# EAGLE design smd_basic_dual_powerb.test1 (EAGLE 5.06)
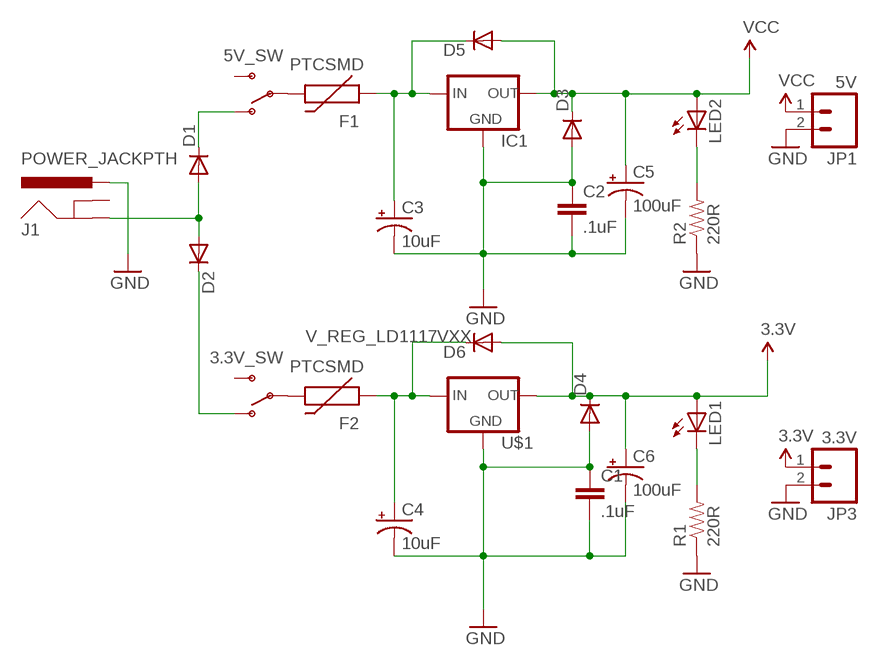
[diagram p0: schematic, sheet 1]

## Parts
3.3V_SW  SWITCH-SPSTSMD2  [SWITCH-SPDT-SMD]
5V_SW  SWITCH-SPSTSMD2  [SWITCH-SPDT-SMD]
C1  .1uF  CAP0603-CAP  [0603-CAP]
C2  .1uF  CAP0603-CAP  [0603-CAP]
C3  10uF  CAP_POL1206  [EIA3216]
C4  10uF  CAP_POL1206  [EIA3216]
C5  100uF  CAP_POL7343  [EIA7343]
C6  100uF  CAP_POL7343  [EIA7343]
D1  DIODESOD  [SOD-323]
D2  DIODESOD  [SOD-323]
D3  DIODESOD  [SOD-323]
D4  DIODESOD  [SOD-323]
D5  DIODESOD  [SOD-323]
D6  DIODESOD  [SOD-323]
F1  PTCSMD  [PTC-1206]
F2  PTCSMD  [PTC-1206]
IC1  V_REG_78XXSIDE  [78XXL]
J1  POWER_JACKPTH  [POWER_JACK_PTH]
JP1  5V  M02LOCK  [1X02_LOCK]
JP3  3.3V  M02LOCK  [1X02_LOCK]
LED1  LEDCHIP-LED0603  [CHIP-LED0603]
LED2  LEDCHIP-LED0603  [CHIP-LED0603]
R1  220R  RESISTOR0603-RES  [0603-RES]
R2  220R  RESISTOR0603-RES  [0603-RES]
U$1  V_REG_LD1117VXX  [78XXL]

## Nets
3.3V: C6.A(+) D4.1(C) D6.2(A) JP3.1 LED1.A U$1.GND(OUT)
GND: C1.1 C1.2 C2.1 C2.2 C3.C(-) C4.C(-) C5.C(-) C6.C(-) D3.2(A) D4.2(A) IC1.GND J1.PWR JP1.2 JP3.2 R1.1 R2.1 U$1.IN(GND)
N$1: D1.2(A) D2.2(A) J1.GND
N$2: 5V_SW.2(P) F1.2
N$3: 3.3V_SW.2(P) F2.2
N$4: 5V_SW.1(O) D1.1(C)
N$5: 3.3V_SW.1(O) D2.1(C)
N$6: C3.A(+) D5.1(C) F1.1 IC1.IN
N$7: C4.A(+) D6.1(C) F2.1 U$1.OUT(IN)
N$12: LED2.C R2.2
N$14: LED1.C R1.2
VCC: C5.A(+) D3.1(C) D5.2(A) IC1.OUT JP1.1 LED2.A
Unconnected: 3.3V_SW.3(S) 5V_SW.3(S) J1.GNDBREAK

## Library data of the parts
3.3V_SW 5V_SW = SparkFun:SWITCH-SPST: SPST Switch Simple slide switch. Spark Fun Electronics SKU : COM-00102
C1 C2 = SparkFun:CAP: Capacitor Standard 0603 ceramic capacitor, and 0.1" leaded capacitor.
C3-C6 = SparkFun:CAP_POL: Capacitor Polarized These are standard SMD and PTH capacitors. Normally 10uF, 47uF, and 100uF in electrolytic and tantalum varieties. Always verify the external diameter of the through hole cap, it varies with capacity, voltage, and manufacturer. The EIA devices should be standard.
D1-D6 = SparkFun:DIODE: Diode These are standard reverse protection diodes and small signal diodes. SMA package can handle up to about 1A. SOD-323 can handle about 200mA. What the SOD-323 package when ordering, there are some mfgs out there that are 5-pin packages.
F1 F2 = SparkFun:PTC: Resettable Fuse PTC Resettable Fuse. Spark Fun Electronics SKU : COM-08357
IC1 = SparkFun:V_REG_78XX: Voltage Regulator Standard 7805 5V regulator. IGO (Input Ground Output). Spark Fun Electronics SKU : COM-00107
J1 = SparkFun:POWER_JACK: Power Jack This is the standard 5.5mm barrel jack for power. The PTH is the most common, proven, reliable, footprint. All others are experimental. The Slot footprint only works if the mill layer is transmitted to the PCB fab house so be warned. Spark Fun Electronics SKU : PRT-00119. Mating wall wart : TOL-00298 (and others)
JP1 JP3 = SparkFun:M02: Header 2 Standard 2-pin 0.1" header. Use with straight break away headers (SKU : PRT-00116), right angle break away headers (PRT-00553), swiss pins (PRT-00743), machine pins (PRT-00117), and female headers (PRT-00115). Molex polarized connector foot print use with SKU : PRT-08233 with associated crimp pins and housings.
LED1 LED2 = led:LED: LED OSRAM: - CHIPLED LG R971, LG N971, LY N971, LG Q971, LY Q971, LO R971, LY R971 LH N974, LH R974 LS Q976, LO Q976, LY Q976 LO Q996 - Hyper CHIPLED LW Q18S LB Q993, LB Q99A, LB R99A - SideLED LS A670, LO A670, LY A670, LG A670, LP A670 LB A673, LV A673, LT A673, LW A673 LH A674 LY A675 LS A676, LA A676, LO A676, LY A676, LW A676 LS A679, LY A679, LG A679 - Hyper Micro SIDELED® LS Y876, LA Y876, LO Y876, LY Y876 LT Y87S - SmartLED LW L88C, LW L88S LB L89C, LB L89S, LG L890 LS L89K, LO L89K, LY L89K LS L896, LA L896, LO L896, LY L896 - TOPLED LS T670, LO T670, LY T670, LG T670, LP T670 LSG T670, LSP T670, LSY T670, LOP T670, LYG T670 LG T671, LOG T671, LSG T671 LB T673, LV T673, LT T673, LW T673 LH T674 LS T676, LA T676, LO T676, LY T676, LB T676, LH T676, LSB T676, LW T676 LB T67C, LV T67C, LT T67C, LS T67K, LO T67K, LY T67K, LW E67C LS E67B, LA E67B, LO E67B, LY E67B, LB E67C, LV E67C, LT E67C LW T67C LS T679, LY T679, LG T679 LS T770, LO T770, LY T770, LG T770, LP T770 LB T773, LV T773, LT T773, LW T773 LH T774 LS E675, LA E675, LY E675, LS T675 LS T776, LA T776, LO T776, LY T776, LB T776 LHGB T686 LT T68C, LB T68C - Hyper Mini TOPLED® LB M676 - Mini TOPLED Santana® LG M470 LS M47K, LO M47K, LY M47K Source: http://www.osram.convergy.de LUXEON: - LUMILED® LXK2-PW12-R00, LXK2-PW12-S00, LXK2-PW14-U00, LXK2-PW14-V00 LXK2-PM12-R00, LXK2-PM12-S00, LXK2-PM14-U00 LXK2-PE12-Q00, LXK2-PE12-R00, LXK2-PE12-S00, LXK2-PE14-T00, LXK2-PE14-U00 LXK2-PB12-K00, LXK2-PB12-L00, LXK2-PB12-M00, LXK2-PB14-N00, LXK2-PB14-P00, LXK2-PB14-Q00 LXK2-PR12-L00, LXK2-PR12-M00, LXK2-PR14-Q00, LXK2-PR14-R00 LXK2-PD12-Q00, LXK2-PD12-R00, LXK2-PD12-S00 LXK2-PH12-R00, LXK2-PH12-S00 LXK2-PL12-P00, LXK2-PL12-Q00, LXK2-PL12-R00 Source: www.luxeon.com KINGBRIGHT: KA-3528ASYC Source: www.kingbright.com
R1 R2 = SparkFun:RESISTOR: Resistor Basic schematic elements and footprints for 0603, 1206, and PTH 1/10th watt (small) resistors.
U$1 = SparkFun:V_REG_LD1117VXX: LD1117VXX voltage regulator. We carry the 3.3V version (COM-00526) in TO-220 package.

## Board
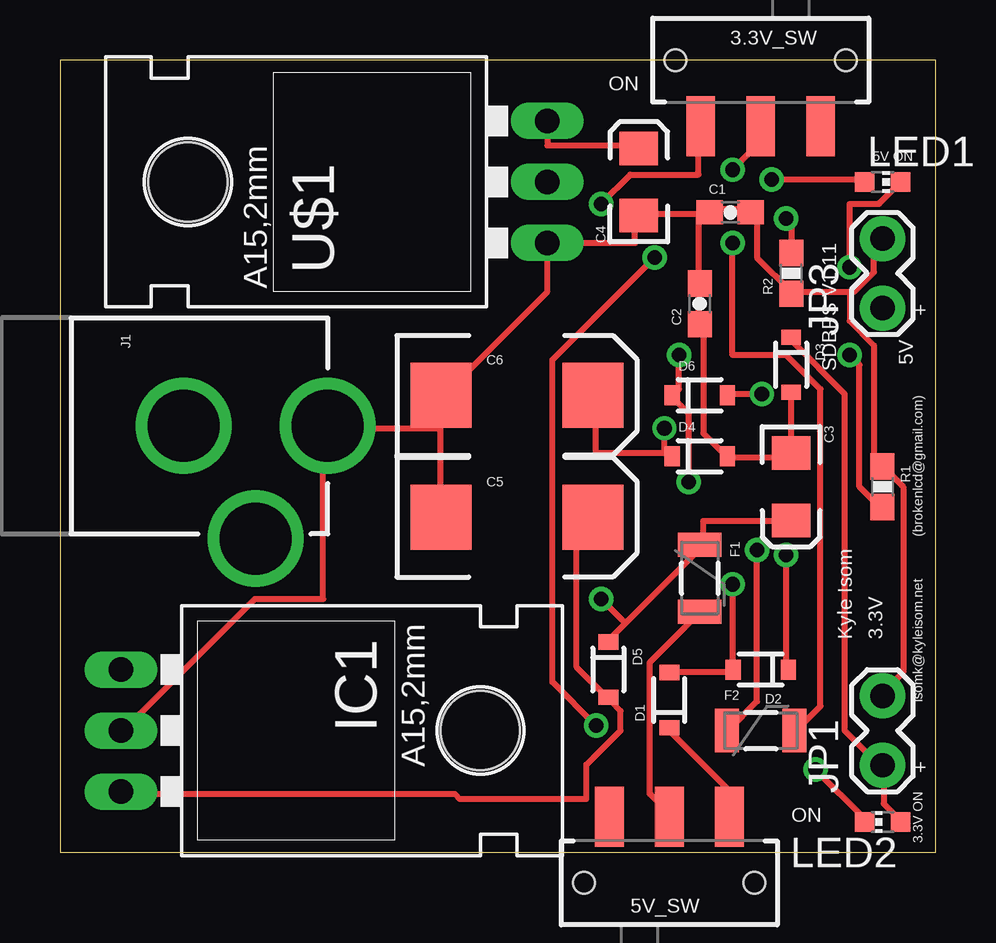
[diagram p1: board, top side]
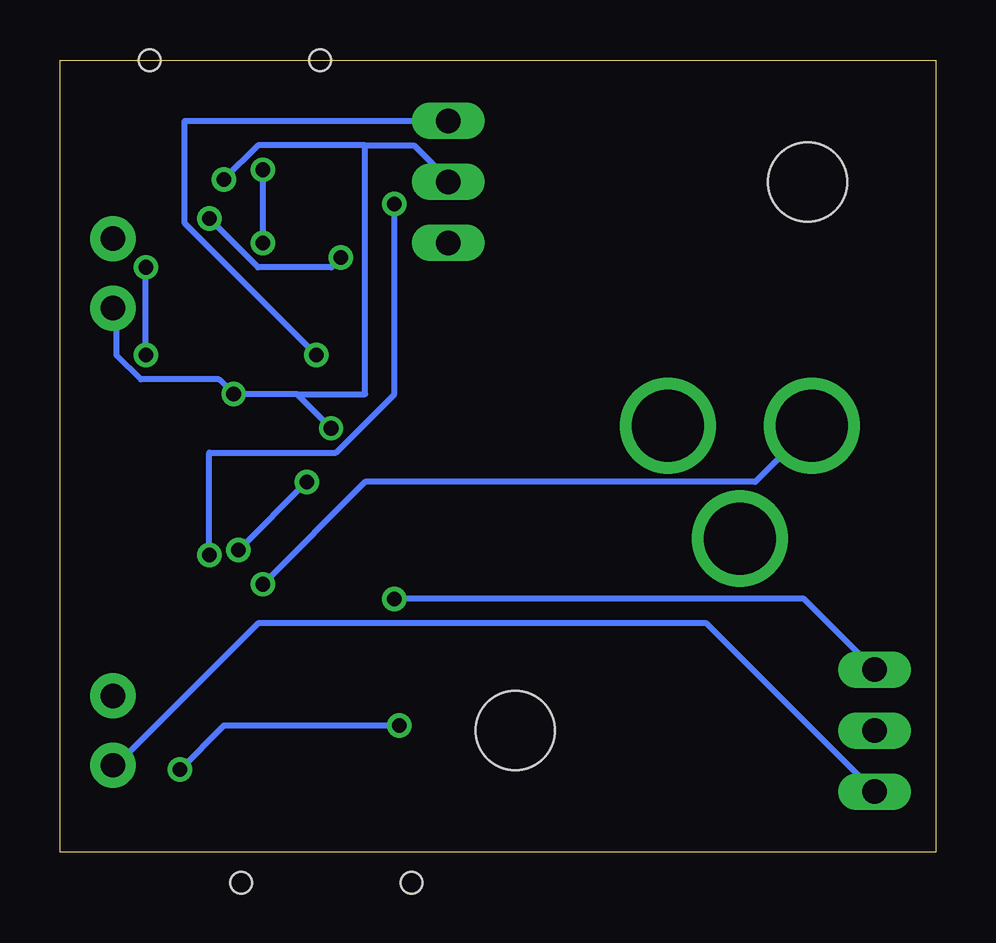
[diagram p2: board, bottom side, seen from below]

Size 36.5 x 33.01 mm. Coordinates in mm from the lower left corner, seen from the top.
Outline: 0,0 36.5,0 36.5,33.01 0,33.01 0,0
Copper layers (1*16): Top 0.035mm / dielectric 1.5mm / Bottom 0.035mm
Design rules "default": minimum track width 10mil, minimum drill 24mil, track to track 8mil, track to pad 8mil, pad to pad 8mil, via to via 8mil, smd to smd 8mil, copper to edge 40mil, drill to drill 8mil, minimum pad ring 10mil, minimum via ring 8mil, stop-mask expansion 4mil, vias tented up to drill 0mil, thermal gap 10mil

### Footprints (pad centres in the part's own frame; a part is rotated, then mirrored left to right if it is on the bottom)
SWITCH-SPDT-SMD = smd 1.2 x 2.5: 1 -2.5,-2.75; 2 0,-2.75; 3 2.5,-2.75 | hole 0.9: -3.55,0; 3.55,0
0603-CAP = smd 1.1 x 1: 1 -0.85,0; 2 0.85,0
EIA3216 = smd 1.4 x 1.6: A 1.4,0; C -1.4,0
EIA7343 = smd 2.55 x 2.7: A 3.17,0; C -3.17,0
SOD-323 = smd 0.63 x 0.83: 1 -1.15,0; 2 1.15,0
PTC-1206 = smd 1 x 1.8: 1 -1.4,0; 2 1.4,0
78XXL = drill 1.016 long: GND 0,-3.81; IN -2.54,-3.81; OUT 2.54,-3.81 | hole 3.302: 0,11.176
POWER_JACK_PTH = drill 2.997 round: GND 0,7.7; GNDBREAK 4.7,10.7; PWR 0,13.7
1X02_LOCK = drill 1.016 pad 1.88 round: 1 -0.178,0; 2 2.718,0
CHIP-LED0603 = smd 0.8 x 0.8: A 0,-0.75; C 0,0.75
0603-RES = smd 1.1 x 1: 1 -0.85,0; 2 0.85,0

### Placement (x,y rotation side)
3.3V_SW  29.21,33.02 0 top
5V_SW  25.4,-1.27 180 top
C1  27.94,26.67 0 top
C2  26.67,22.86 90 top
C3  30.48,15.24 270 top
C4  24.13,27.94 90 top
C5  19.05,13.97 0 top
C6  19.05,19.05 0 top
D1  25.4,6.35 90 top
D2  29.21,7.62 180 top
D3  30.48,20.32 270 top
D4  26.67,16.51 0 top
D5  22.86,7.62 270 top
D6  26.67,19.05 0 top
F1  26.67,11.43 270 top
F2  29.21,5.08 0 top
IC1  6.35,5.08 270 top
J1  -2.54,17.78 270 top
JP1  34.29,3.81 90 top
JP3  34.29,22.86 90 top
LED1  34.29,27.94 270 top
LED2  34.29,1.27 90 top
R1  34.29,15.24 270 top
R2  30.48,24.13 90 top
U$1  16.51,27.94 90 top

### Tracks (layer width: path | path; a pad name or v marks a point on that pad's centre or on a via)
3.3V  (via drill 0.61)
  Top 0.254: v29.67,28.04 33.53,28.04 LED1.A | 25.2,16.66 22.35,16.66 22.35,18.9 C6.A | 25.2,16.66 25.4,16.66 D4.1 | v29.26,19.1 27.84,19.1 D6.2 | 25.2,16.66 v25.2,17.68
  Bottom 0.254: v29.67,28.04 28.25,29.46 23.77,29.46 | 23.77,29.46 21.74,29.46 20.32,28.04 U$1.GND | JP3.1 34.14,22.55 34.14,20.73 33.12,19.71 29.87,19.71 v29.26,19.1 26.62,19.1 | v25.2,17.68 26.62,19.1 | 23.77,29.46 23.77,19.1 26.62,19.1
GND
  Top 0.254: 15.85,17.68 15.85,18.9 C6.C 16.05,19.1 20.32,23.37 U$1.IN 23.98,25.4 23.98,26.42 C4.C 24.18,26.62 26.62,26.62 | 15.85,17.68 15.85,14.02 C5.C | IC1.GND 2.64,5.08 8.13,10.57 10.97,10.57 10.97,17.68 J1.PWR 11.18,17.68 15.85,17.68 | JP1.2 34.34,6.71 35.15,7.52 35.15,15.24 34.34,16.05 R1.1 34.14,16.26 33.93,16.46 33.93,21.13 32.92,22.15 32.92,23.37 | D3.2 C3.C 30.48,16.46 27.84,16.46 D4.2 27.64,16.66 26.82,17.48 26.82,21.95 C2.1 26.62,22.15 26.62,23.57 C2.2 26.62,23.77 26.62,26.62 | C1.1 27.23,26.82 28.65,26.82 C1.2 28.85,26.62 29.06,26.42 29.06,24.79 30.48,23.37 | 26.62,26.62 27.03,26.62 C1.1 | 26.62,26.62 C1.1 | 30.48,23.37 32.92,23.37 | 32.92,23.37 33.12,23.37 33.93,24.18 33.93,25.2 34.14,25.4 JP3.2 | 30.48,23.37 R2.1
N$1  (via drill 0.61)
  Top 0.254: D1.2 25.4,7.52 28.04,7.52 D2.2 28.04,7.72 v28.04,11.18
  Bottom 0.254: v28.04,11.18 23.77,15.44 7.52,15.44 5.28,17.68 J1.GND
N$2
  Top 0.254: F1.2 26.62,9.96 24.59,7.92 24.59,2.44 25.4,1.63 5V_SW.2
N$3  (via drill 0.61)
  Top 0.254: v28.04,25.4 28.04,20.73 30.28,20.73 31.7,19.3 31.7,6.1 30.68,5.08 F2.2 | v28.04,28.45 29.06,29.46 29.06,30.07 3.3V_SW.2
  Bottom 0.254: v28.04,25.4 v28.04,28.45
N$4
  Top 0.254: D1.1 25.4,5.08 27.84,2.64 27.84,1.63 5V_SW.1
N$5  (via drill 0.61)
  Top 0.254: v30.28,12.39 30.28,7.72 D2.1 | v22.55,27.03 23.77,28.25 26.62,28.25 26.62,30.07 3.3V_SW.1
  Bottom 0.254: v30.28,12.39 30.28,16.66 24.99,16.66 22.55,19.1 v22.55,27.03
N$6  (via drill 0.61)
  Top 0.254: 23.57,9.55 26.62,12.6 26.62,12.8 F1.1 26.82,13.01 26.82,13.82 30.48,13.82 C3.A | 23.57,9.55 22.96,8.94 D5.1 | v22.55,10.57 23.57,9.55
  Bottom 0.254: v22.55,10.57 5.49,10.57 IC1.IN
N$7  (via drill 0.61)
  Top 0.254: v25.81,20.73 25.81,19.3 25.6,19.1 D6.1 25.6,18.9 26.21,18.29 v26.21,15.44 | U$1.OUT 20.32,29.46 23.98,29.46 C4.A | v29.06,12.6 29.06,6.3 27.84,5.08 F2.1
  Bottom 0.254: v25.81,20.73 31.29,26.21 31.29,30.48 U$1.OUT | v29.06,12.6 v26.21,15.44
N$12  (via drill 0.61)
  Top 0.254: v31.5,3.45 33.53,1.42 LED2.C | v22.35,5.28 20.52,7.11 20.52,20.52 v24.79,24.79 | v30.28,26.42 30.48,26.21 R2.2
  Bottom 0.254: v31.5,3.45 29.67,5.28 v22.35,5.28 | v24.79,24.79 25.2,24.38 28.25,24.38 v30.28,26.42
N$14  (via drill 0.61)
  Top 0.254: v32.92,24.38 32.92,27.03 34.14,27.03 34.95,27.84 LED1.C | v32.92,20.73 33.33,20.32 33.33,15.24 34.14,14.43 R1.2
  Bottom 0.254: v32.92,20.73 v32.92,24.38
VCC
  Top 0.254: LED2.A 34.95,1.42 34.34,2.03 34.34,3.45 JP1.1 34.14,3.66 32.72,5.08 32.72,19.1 30.48,21.34 D3.1 | C5.A 22.15,13.82 21.54,13.21 21.54,7.72 22.76,6.5 D5.2 22.96,6.3 23.37,5.89 23.37,5.08 21.95,3.66 21.95,2.23 16.66,2.23 16.46,2.44 2.64,2.44 IC1.OUT
  Bottom 0.254: JP1.1 34.14,3.66 28.25,9.55 9.55,9.55 IC1.OUT

### Text on the board
tPlace: ON | 5V ON | SDBPS V1.11 | + | 5V | (brokenlcd@gmail.com) | isomk@kyleisom.net | Kyle Isom | 3.3V | + | 3.3V ON | ON